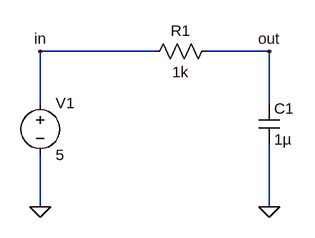
[diagram p0: schematic netlist_example1.asc]
netlist_example1.asc, the LTspice schematic file:
Version 4.1
SHEET 1 880 680
WIRE 208 32 32 32
WIRE 384 32 288 32
WIRE 32 112 32 32
WIRE 384 112 384 32
WIRE 32 272 32 192
WIRE 384 272 384 176
FLAG 32 272 0
FLAG 384 272 0
FLAG 32 32 in
FLAG 384 32 out
SYMBOL voltage 32 96 R0
WINDOW 123 0 0 Left 0
WINDOW 39 0 0 Left 0
SYMATTR InstName V1
SYMATTR Value 5
SYMBOL res 304 16 R90
WINDOW 0 0 56 VBottom 2
WINDOW 3 32 56 VTop 2
SYMATTR InstName R1
SYMATTR Value 1k
SYMBOL cap 368 112 R0
SYMATTR InstName C1
SYMATTR Value 1µ

The netlist it stands for:
* netlist_example1.asc
V1 in 0 5
R1 out in 1k
C1 out 0 1µ
.backanno
.end